# EAGLE schematic mp_rollerball (EAGLE 7.7.0)
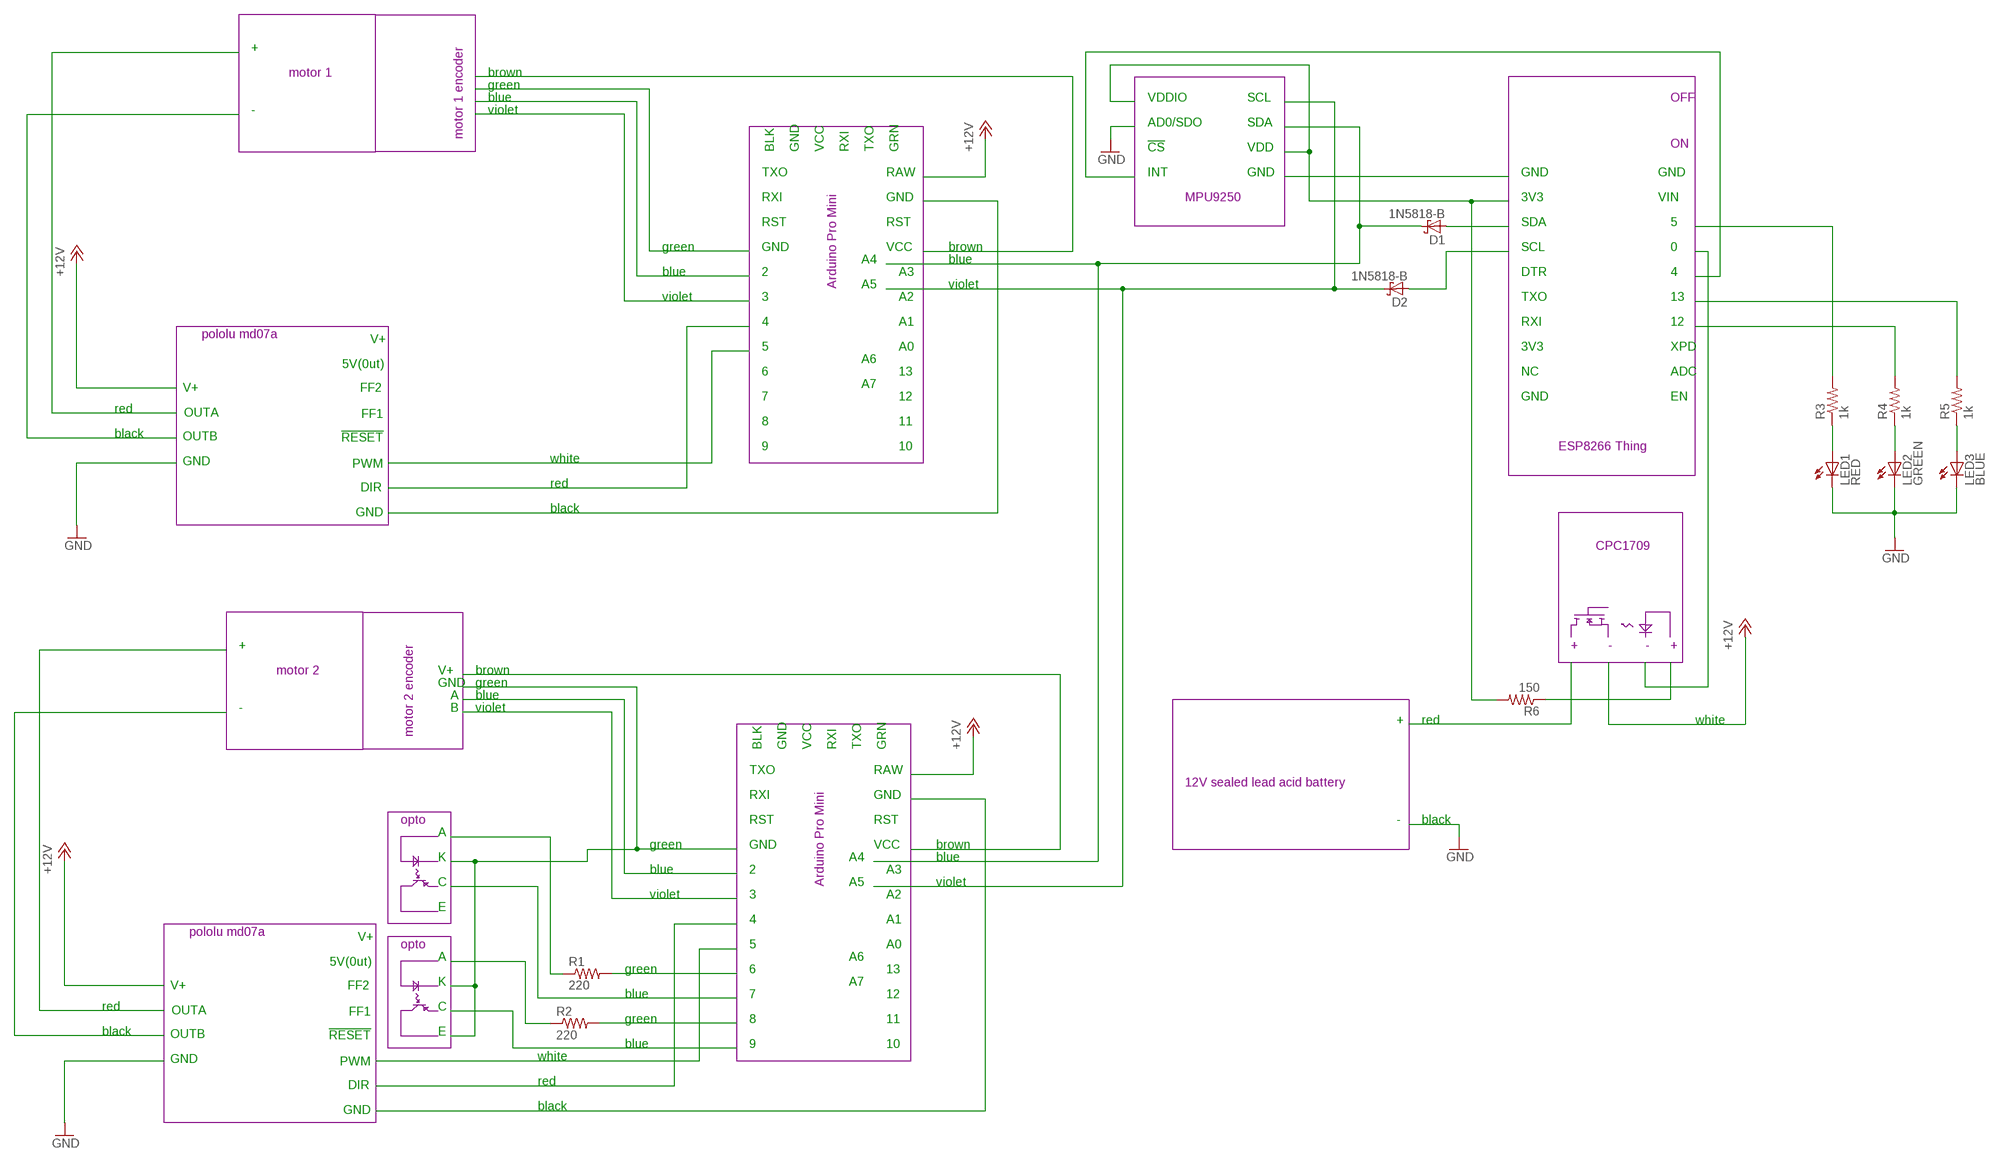
[diagram p0: schematic, sheet 1]

## Parts
D1  1N5818-B  [DO41-7.6]
D2  1N5818-B  [DO41-7.6]
LED1  RED  LED5MM  [LED5MM]
LED2  GREEN  LED5MM  [LED5MM]
LED3  BLUE  LED5MM  [LED5MM]
R1  220  R-US_0207/10  [0207/10]
R2  220  R-US_0207/10  [0207/10]
R3  1k  R-US_0207/10  [0207/10]
R4  1k  R-US_0207/10  [0207/10]
R5  1k  R-US_0207/10  [0207/10]
R6  150  R-US_0207/10  [0207/10]

## Nets
GND: LED1.K(C) LED2.K(C) LED3.K(C)
N$1: R1.1
N$5: R3.2
N$6: R4.2
N$7: R1.2
N$9: R2.2
N$17: R5.2
N$18: R2.1
N$20: LED1.A R3.1
N$24: D1.C
N$25: D2.C
N$26: LED2.A R4.1
N$27: LED3.A R5.1
N$28: D1.A
N$29: D2.A
N$38: R6.2
N$40: R6.1

## Notes on the sheet
- +
- motor 1 | brown
- green
- blue | VDDIO | SCL | OFF
- - | violet
- AD0/SDO | SDA
- motor 1 encoder | ON
- BLK | GND | VCC | RXI | TXO | GRN | !CS | VDD
- TXO | RAW | INT | GND | GND | GND
- RXI | GND | MPU9250 | 3V3 | VIN
- RST | RST | SDA | 5
- green | GND | VCC | brown | SCL | 0
- A4 | blue
- blue | 2 | A3 | DTR | 4
- Arduino Pro Mini | A5 | violet
- violet | 3 | A2 | TXO | 13
- 4 | A1 | RXI | 12
- V+
- pololu md07a
- 5 | A0 | 3V3 | XPD
- 5V(0ut)
- A6
- 6 | 13 | NC | ADC
- FF2
- A7
- V+
- 7 | 12 | GND | EN
- FF1
- red
- OUTA
- 8 | 11
- !RESET
- black | OUTB
- 9 | 10 | ESP8266 Thing
- PWM
- GND | white
- DIR
- red
- GND
- black
- CPC1709
- + | + | - | - | +
- motor 2 | V+ | brown
- GND | green
- A | blue
- - | B | violet
- + | red | white
- motor 2 encoder
- BLK | GND | VCC | RXI | TXO | GRN
- TXO | RAW
- 12V sealed lead acid battery
- RXI | GND
- opto | RST | RST | - | black
- A
- green | GND | VCC | brown
- K | A4 | blue
- blue | 2 | A3
- C | Arduino Pro Mini | A5 | violet
- violet | 3 | A2
- E
- 4 | A1
- V+
- pololu md07a
- opto | 5 | A0
- 5V(0ut)
- A | A6
- green | 6 | 13
- FF2
- K | A7
- V+
- blue | 7 | 12
- FF1
- red | C
- OUTA
- green | 8 | 11
- !RESET
- black | OUTB | E
- blue | 9 | 10
- PWM
- GND | white
- DIR
- red
- GND
- black

## Library data of the parts
D1 D2 = diode:1N581*: 1.0A SCHOTTKY BARRIER RECTIFIER Source: http://www.diodes.com/datasheets/ds23001.pdf
LED1-LED3 = led:LED: LED OSRAM: - CHIPLED LG R971, LG N971, LY N971, LG Q971, LY Q971, LO R971, LY R971 LH N974, LH R974 LS Q976, LO Q976, LY Q976 LO Q996 - Hyper CHIPLED LW Q18S LB Q993, LB Q99A, LB R99A - SideLED LS A670, LO A670, LY A670, LG A670, LP A670 LB A673, LV A673, LT A673, LW A673 LH A674 LY A675 LS A676, LA A676, LO A676, LY A676, LW A676 LS A679, LY A679, LG A679 - Hyper Micro SIDELED® LS Y876, LA Y876, LO Y876, LY Y876 LT Y87S - SmartLED LW L88C, LW L88S LB L89C, LB L89S, LG L890 LS L89K, LO L89K, LY L89K LS L896, LA L896, LO L896, LY L896 - TOPLED LS T670, LO T670, LY T670, LG T670, LP T670 LSG T670, LSP T670, LSY T670, LOP T670, LYG T670 LG T671, LOG T671, LSG T671 LB T673, LV T673, LT T673, LW T673 LH T674 LS T676, LA T676, LO T676, LY T676, LB T676, LH T676, LSB T676, LW T676 LB T67C, LV T67C, LT T67C, LS T67K, LO T67K, LY T67K, LW E67C LS E67B, LA E67B, LO E67B, LY E67B, LB E67C, LV E67C, LT E67C LW T67C LS T679, LY T679, LG T679 LS T770, LO T770, LY T770, LG T770, LP T770 LB T773, LV T773, LT T773, LW T773 LH T774 LS E675, LA E675, LY E675, LS T675 LS T776, LA T776, LO T776, LY T776, LB T776 LHGB T686 LT T68C, LB T68C - Hyper Mini TOPLED® LB M676 - Mini TOPLED Santana® LG M470 LS M47K, LO M47K, LY M47K Source: http://www.osram.convergy.de LUXEON: - LUMILED® LXK2-PW12-R00, LXK2-PW12-S00, LXK2-PW14-U00, LXK2-PW14-V00 LXK2-PM12-R00, LXK2-PM12-S00, LXK2-PM14-U00 LXK2-PE12-Q00, LXK2-PE12-R00, LXK2-PE12-S00, LXK2-PE14-T00, LXK2-PE14-U00 LXK2-PB12-K00, LXK2-PB12-L00, LXK2-PB12-M00, LXK2-PB14-N00, LXK2-PB14-P00, LXK2-PB14-Q00 LXK2-PR12-L00, LXK2-PR12-M00, LXK2-PR14-Q00, LXK2-PR14-R00 LXK2-PD12-Q00, LXK2-PD12-R00, LXK2-PD12-S00 LXK2-PH12-R00, LXK2-PH12-S00 LXK2-PL12-P00, LXK2-PL12-Q00, LXK2-PL12-R00 Source: www.luxeon.com KINGBRIGHT: KA-3528ASYC Source: www.kingbright.com
R1-R6 = rcl:R-US_: RESISTOR, American symbol